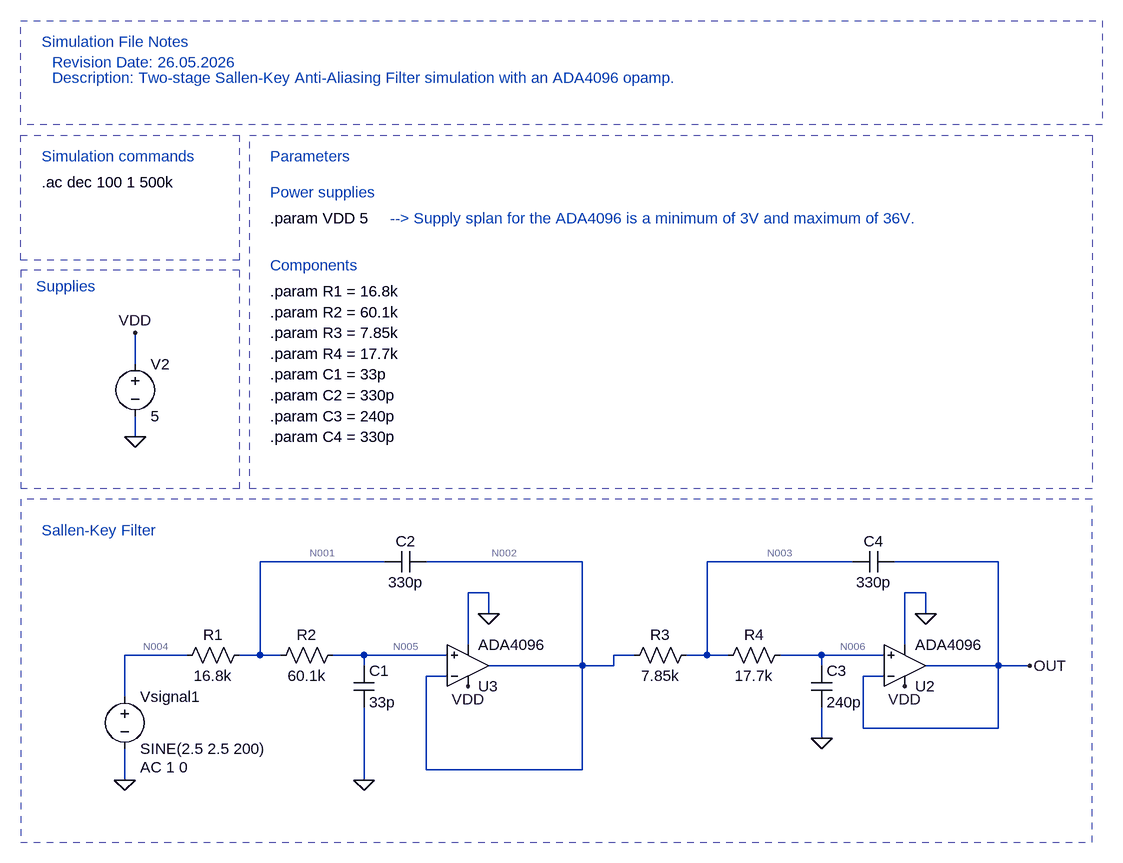
[diagram p0: schematic Sallen_Key_Filter_2Stage.asc]
Sallen_Key_Filter_2Stage.asc, the LTspice schematic file:
Version 4.1
SHEET 1 1592 680
WIRE 96 -432 96 -480
WIRE 96 -320 96 -352
WIRE 480 -128 288 -128
WIRE 784 -128 544 -128
WIRE 1200 -128 976 -128
WIRE 1424 -128 1264 -128
WIRE 640 -80 608 -80
WIRE 1312 -80 1280 -80
WIRE 640 -48 640 -80
WIRE 1312 -48 1312 -80
WIRE 608 0 608 -80
WIRE 1280 0 1280 -80
WIRE 176 16 80 16
WIRE 288 16 288 -128
WIRE 288 16 256 16
WIRE 320 16 288 16
WIRE 448 16 400 16
WIRE 576 16 448 16
WIRE 864 16 832 16
WIRE 976 16 976 -128
WIRE 976 16 944 16
WIRE 1008 16 976 16
WIRE 1152 16 1088 16
WIRE 1248 16 1152 16
WIRE 448 32 448 16
WIRE 784 32 784 -128
WIRE 784 32 640 32
WIRE 832 32 832 16
WIRE 832 32 784 32
WIRE 1152 32 1152 16
WIRE 1424 32 1424 -128
WIRE 1424 32 1312 32
WIRE 1472 32 1424 32
WIRE 576 48 544 48
WIRE 1248 48 1216 48
WIRE 80 80 80 16
WIRE 1216 128 1216 48
WIRE 1424 128 1424 32
WIRE 1424 128 1216 128
WIRE 1152 144 1152 96
WIRE 544 192 544 48
WIRE 784 192 784 32
WIRE 784 192 544 192
WIRE 80 208 80 160
WIRE 448 208 448 96
FLAG 80 208 0
FLAG 448 208 0
FLAG 1152 144 0
FLAG 640 -48 0
FLAG 1312 -48 0
FLAG 96 -320 0
FLAG 96 -480 VDD
FLAG 608 64 VDD
FLAG 1280 64 VDD
FLAG 1472 32 OUT
SYMBOL voltage 80 64 R0
WINDOW 123 24 124 Left 2
WINDOW 39 0 0 Left 0
SYMATTR Value2 AC 1 0
SYMATTR InstName Vsignal1
SYMATTR Value SINE(2.5 2.5 200)
SYMBOL res 272 0 R90
WINDOW 0 0 56 VBottom 2
WINDOW 3 32 56 VTop 2
SYMATTR InstName R1
SYMATTR Value 16.8k
SYMBOL res 416 0 R90
WINDOW 0 0 56 VBottom 2
WINDOW 3 32 56 VTop 2
SYMATTR InstName R2
SYMATTR Value 60.1k
SYMBOL cap 432 32 R0
SYMATTR InstName C1
SYMATTR Value 33p
SYMBOL cap 544 -144 R90
WINDOW 0 0 32 VBottom 2
WINDOW 3 32 32 VTop 2
SYMATTR InstName C2
SYMATTR Value 330p
SYMBOL res 960 0 R90
WINDOW 0 0 56 VBottom 2
WINDOW 3 32 56 VTop 2
SYMATTR InstName R3
SYMATTR Value 7.85k
SYMBOL res 1104 0 R90
WINDOW 0 0 56 VBottom 2
WINDOW 3 32 56 VTop 2
SYMATTR InstName R4
SYMATTR Value 17.7k
SYMBOL cap 1136 32 R0
SYMATTR InstName C3
SYMATTR Value 240p
SYMBOL cap 1264 -144 R90
WINDOW 0 0 32 VBottom 2
WINDOW 3 32 32 VTop 2
SYMATTR InstName C4
SYMATTR Value 330p
SYMBOL OpAmps\\ADA4096 1280 96 M180
SYMATTR InstName U2
SYMBOL OpAmps\\ADA4096 608 96 M180
SYMATTR InstName U3
SYMBOL voltage 96 -448 R0
WINDOW 123 0 0 Left 0
WINDOW 39 0 0 Left 0
SYMATTR InstName V2
SYMATTR Value 5
TEXT -48 -176 Left 2 ;Sallen-Key Filter
TEXT -56 -552 Left 2 ;Supplies
TEXT -48 -712 Left 2 !.ac dec 100 1 500k
TEXT -48 -752 Left 2 ;Simulation commands
TEXT 304 -752 Left 2 ;Parameters
TEXT 304 -696 Left 2 ;Power supplies
TEXT 304 -656 Left 2 !.param VDD 5
TEXT 304 -584 Left 2 ;Components
TEXT 304 -544 Left 2 !.param R1 = 16.8k
TEXT 304 -512 Left 2 !.param R2 = 60.1k
TEXT 304 -480 Left 2 !.param R3 = 7.85k
TEXT 304 -448 Left 2 !.param R4 = 17.7k
TEXT 304 -416 Left 2 !.param C1 = 33p
TEXT 304 -384 Left 2 !.param C2 = 330p
TEXT 304 -352 Left 2 !.param C3 = 240p
TEXT 304 -320 Left 2 !.param C4 = 330p
TEXT -48 -928 Left 2 ;Simulation File Notes
TEXT -32 -896 Left 2 ;Revision Date: 26.05.2026
TEXT -32 -872 Left 2 ;Description: Two-stage Sallen-Key Anti-Aliasing Filter simulation with an ADA4096 opamp.
TEXT 488 -656 Left 2 ;--> Supply splan for the ADA4096 is a minimum of 3V and maximum of 36V.
LINE Normal 1568 -224 -80 -224 2
LINE Normal 1568 304 1568 -224 2
LINE Normal -80 304 1568 304 2
LINE Normal -80 -224 -80 304 2
LINE Normal 256 -240 -80 -240 2
LINE Normal 256 -576 256 -240 2
LINE Normal -80 -576 -80 -240 2
LINE Normal 256 -576 -80 -576 2
RECTANGLE Normal 256 -592 -80 -784 2
RECTANGLE Normal 1568 -240 272 -784 2
RECTANGLE Normal 1584 -800 -80 -960 2

The netlist it stands for:
* Sallen_Key_Filter_2Stage.asc
Vsignal1 N004 0 SINE(2.5 2.5 200) AC 1 0
R1 N001 N004 16.8k
R2 N005 N001 60.1k
C1 N005 0 33p
C2 N002 N001 330p
R3 N003 N002 7.85k
R4 N006 N003 17.7k
C3 N006 0 240p
C4 OUT N003 330p
X§U2 N006 OUT VDD 0 OUT ADA4096  ; pins In+ In- V+ V- OUT
X§U3 N005 N002 VDD 0 N002 ADA4096  ; pins In+ In- V+ V- OUT
V2 VDD 0 5
* Sallen-Key Filter
* Supplies
.ac dec 100 1 500k
* Simulation commands
* Parameters
* Power supplies
.param VDD 5
* Components
.param R1 = 16.8k
.param R2 = 60.1k
.param R3 = 7.85k
.param R4 = 17.7k
.param C1 = 33p
.param C2 = 330p
.param C3 = 240p
.param C4 = 330p
* Simulation File Notes
* Revision Date: 26.05.2026
* Description: Two-stage Sallen-Key Anti-Aliasing Filter simulation with an ADA4096 opamp.
* --> Supply splan for the ADA4096 is a minimum of 3V and maximum of 36V.
.backanno
.end

* Results of the author's LTspice run, read from the files saved beside the schematic
* Operating Point, zero values left out:
*   V(n001) = 2.5 V
*   V(n002) = 2.499 V
*   V(n003) = 2.499 V
*   V(n004) = 2.5 V
*   V(n005) = 2.499 V
*   V(n006) = 2.499 V
*   V(out) = 2.499 V
*   V(vdd) = 5 V
*   I(R1) = -10 nA
*   I(R2) = -10 nA
*   I(R3) = -10 nA
*   I(R4) = -10 nA
*   I(V2) = -94.03 µA
*   I(Vsignal1) = -10 nA
*   Ix(u2:1) = 10 nA
*   Ix(u2:2) = 8.5 nA
*   Ix(u2:3) = 47.01 µA
*   Ix(u2:4) = -47.01 µA
*   Ix(u2:5) = -8.5 nA
*   Ix(u3:1) = 10 nA
*   Ix(u3:2) = 8.5 nA
*   Ix(u3:3) = 47.02 µA
*   Ix(u3:4) = -47.02 µA
*   Ix(u3:5) = -18.5 nA
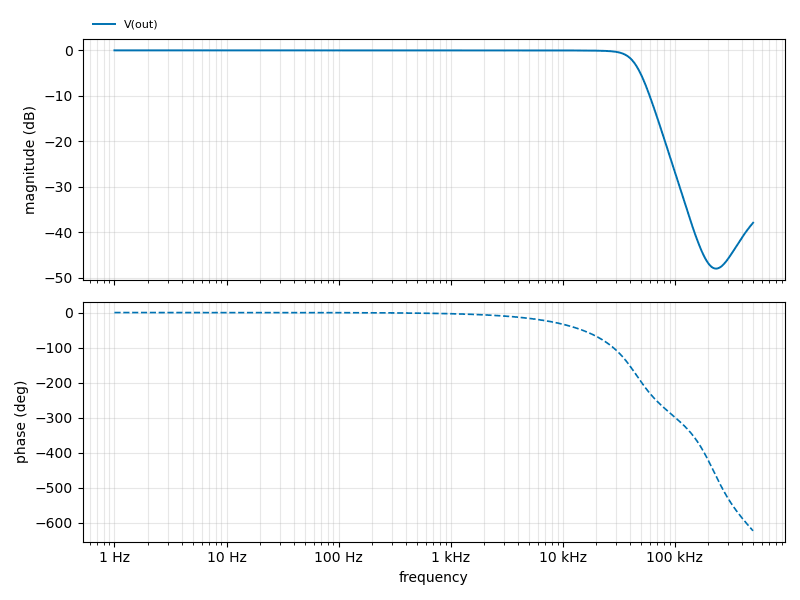
[diagram p1: AC Analysis of Sallen_Key_Filter_2Stage.asc, plotted from the saved traces]
* AC Analysis, 1 run:
*   V(out): -0.00 dB at 1 Hz, -37.88 dB at 500 kHz, peak -0.00 dB at 1 Hz, 3 dB below the peak at 44.33 kHz